# EAGLE design tm4cShield_v2.0 (EAGLE 8.0.0)
CNAME: ARL

## Sheet 1 of 2: Power Input, Conditioning
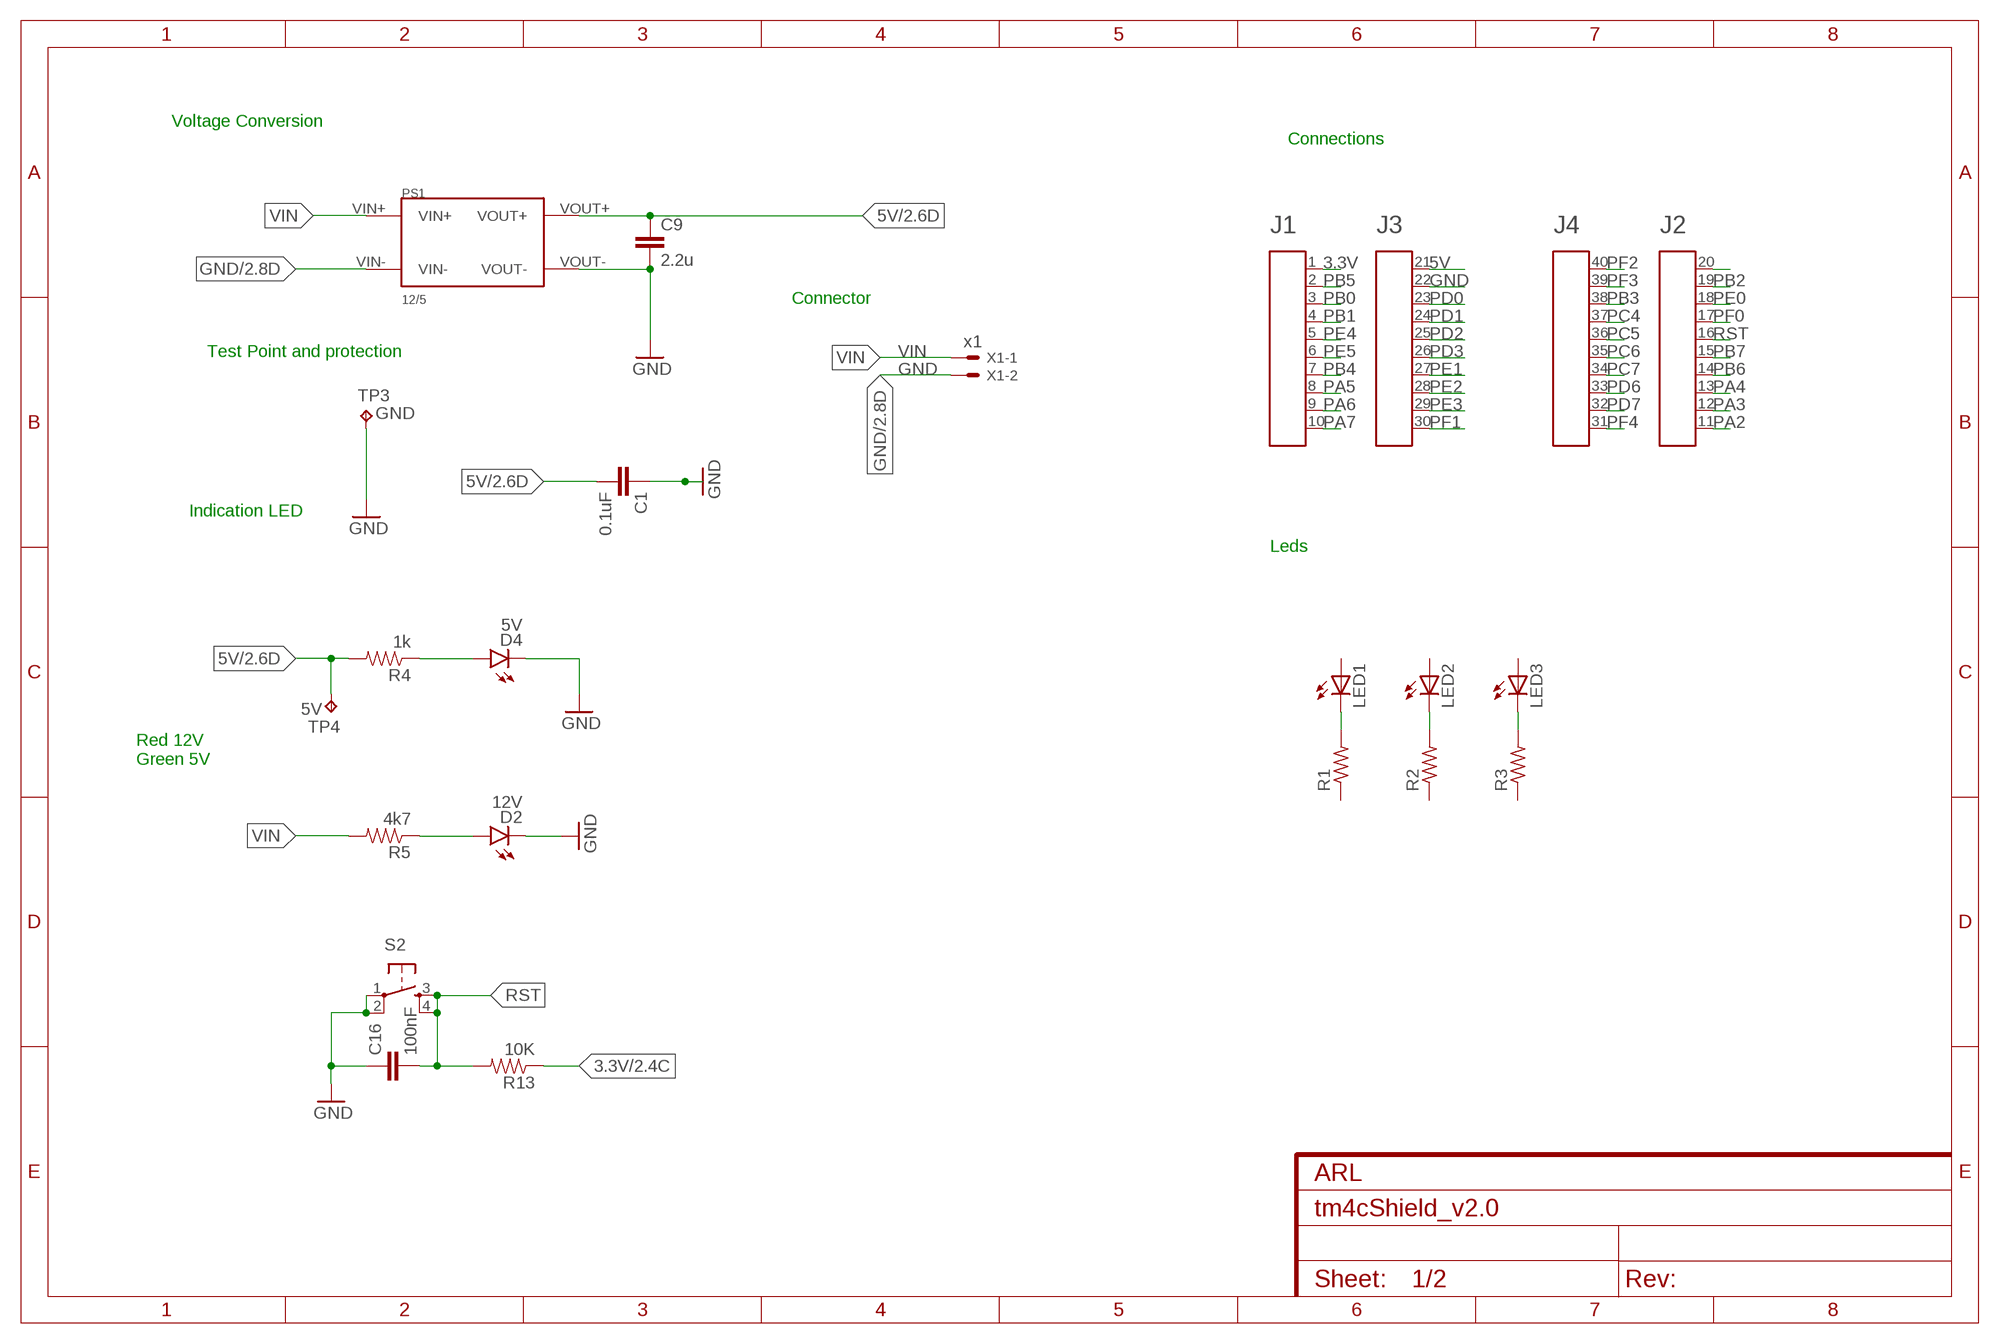
[diagram p0: schematic, sheet 1]

### Parts
A1  HEADER4X10-BOOSTERPACK  [4X10-BOOSTERPACK]
C1  0.1uF  0.1UF-0603-25V-(+80/-20%)  [0603]
C9  2.2u  2.2U_CAPACITOR_0603  [0603-CAP]
C16  100nF  CAP0603-CAP  [0603-CAP]
D2  12V  YELLOW_LED_0603  [LED-0603]
D4  5V  BLUE_LED_0603  [LED-0603]
LED1  LED0603  [LED-0603]
LED2  LED0603  [LED-0603]
LED3  LED0603  [LED-0603]
PS1  12/5  MURATA_NMG2405SC  [MURATA_NMG]
R1  RESISTOR_0603  [RESC0603]
R2  RESISTOR_0603  [RESC0603]
R3  RESISTOR_0603  [RESC0603]
R4  1k  1K_RESISTOR_0603  [0603-RES]
R5  4k7  4K7_RESISTOR_0603  [0603-RES]
R13  10K  RESISTOR0603-RES  [0603-RES]
S2  TAC_SWITCHPTH  [TACTILE-PTH]
TP3  GND  TP5000  [5000_SERIES_TESTPOINT]
TP4  5V  TP5000  [5000_SERIES_TESTPOINT]
X1  x1  53261-02  [53261-02]

### Nets
3.3V: A1.1 R13.1 ; also sheet 2
5V: A1.21 C1.2 C9.1 PS1.VOUT+ R4.2 TP4.P$1(TP) ; also sheet 2
GND: A1.22 C1.1 C9.2 C16.1 D2.C D4.C PS1.VIN- PS1.VOUT- S2.1 S2.2 TP3.P$1(TP) X1.2 ; also sheet 2
N$1: D4.A R4.1
N$2: LED1.C R1.2
N$6: LED2.C R2.2
N$7: LED3.C R3.2
N$14: A1.20
N$35: D2.A R5.1
PA2: A1.11 ; also sheet 2
PA3: A1.12
PA4: A1.13 ; also sheet 2
PA5: A1.8
PA6: A1.9
PA7: A1.10
PB0: A1.3
PB1: A1.4
PB2: A1.19
PB3: A1.38
PB4: A1.7 ; also sheet 2
PB5: A1.2 ; also sheet 2
PB6: A1.14
PB7: A1.15
PC4: A1.37 ; also sheet 2
PC5: A1.36 ; also sheet 2
PC6: A1.35 ; also sheet 2
PC7: A1.34
PD0: A1.23
PD1: A1.24
PD2: A1.25
PD3: A1.26
PD6: A1.33
PD7: A1.32
PE0: A1.18 ; also sheet 2
PE1: A1.27
PE2: A1.28 ; also sheet 2
PE3: A1.29 ; also sheet 2
PE4: A1.5
PE5: A1.6
PF0: A1.17
PF1: A1.30
PF2: A1.40
PF3: A1.39
PF4: A1.31
RST: A1.16 C16.2 R13.2 S2.3 S2.4
VIN: PS1.VIN+ R5.2 X1.1 ; also sheet 2
Unconnected: LED1.A LED2.A LED3.A R1.1 R2.1 R3.1

### Notes on the sheet
- Voltage Conversion
- Connections
- Connector
- Test Point and protection
- Indication LED
- Leds
- Red 12V
  Green 5V

## Sheet 2 of 2
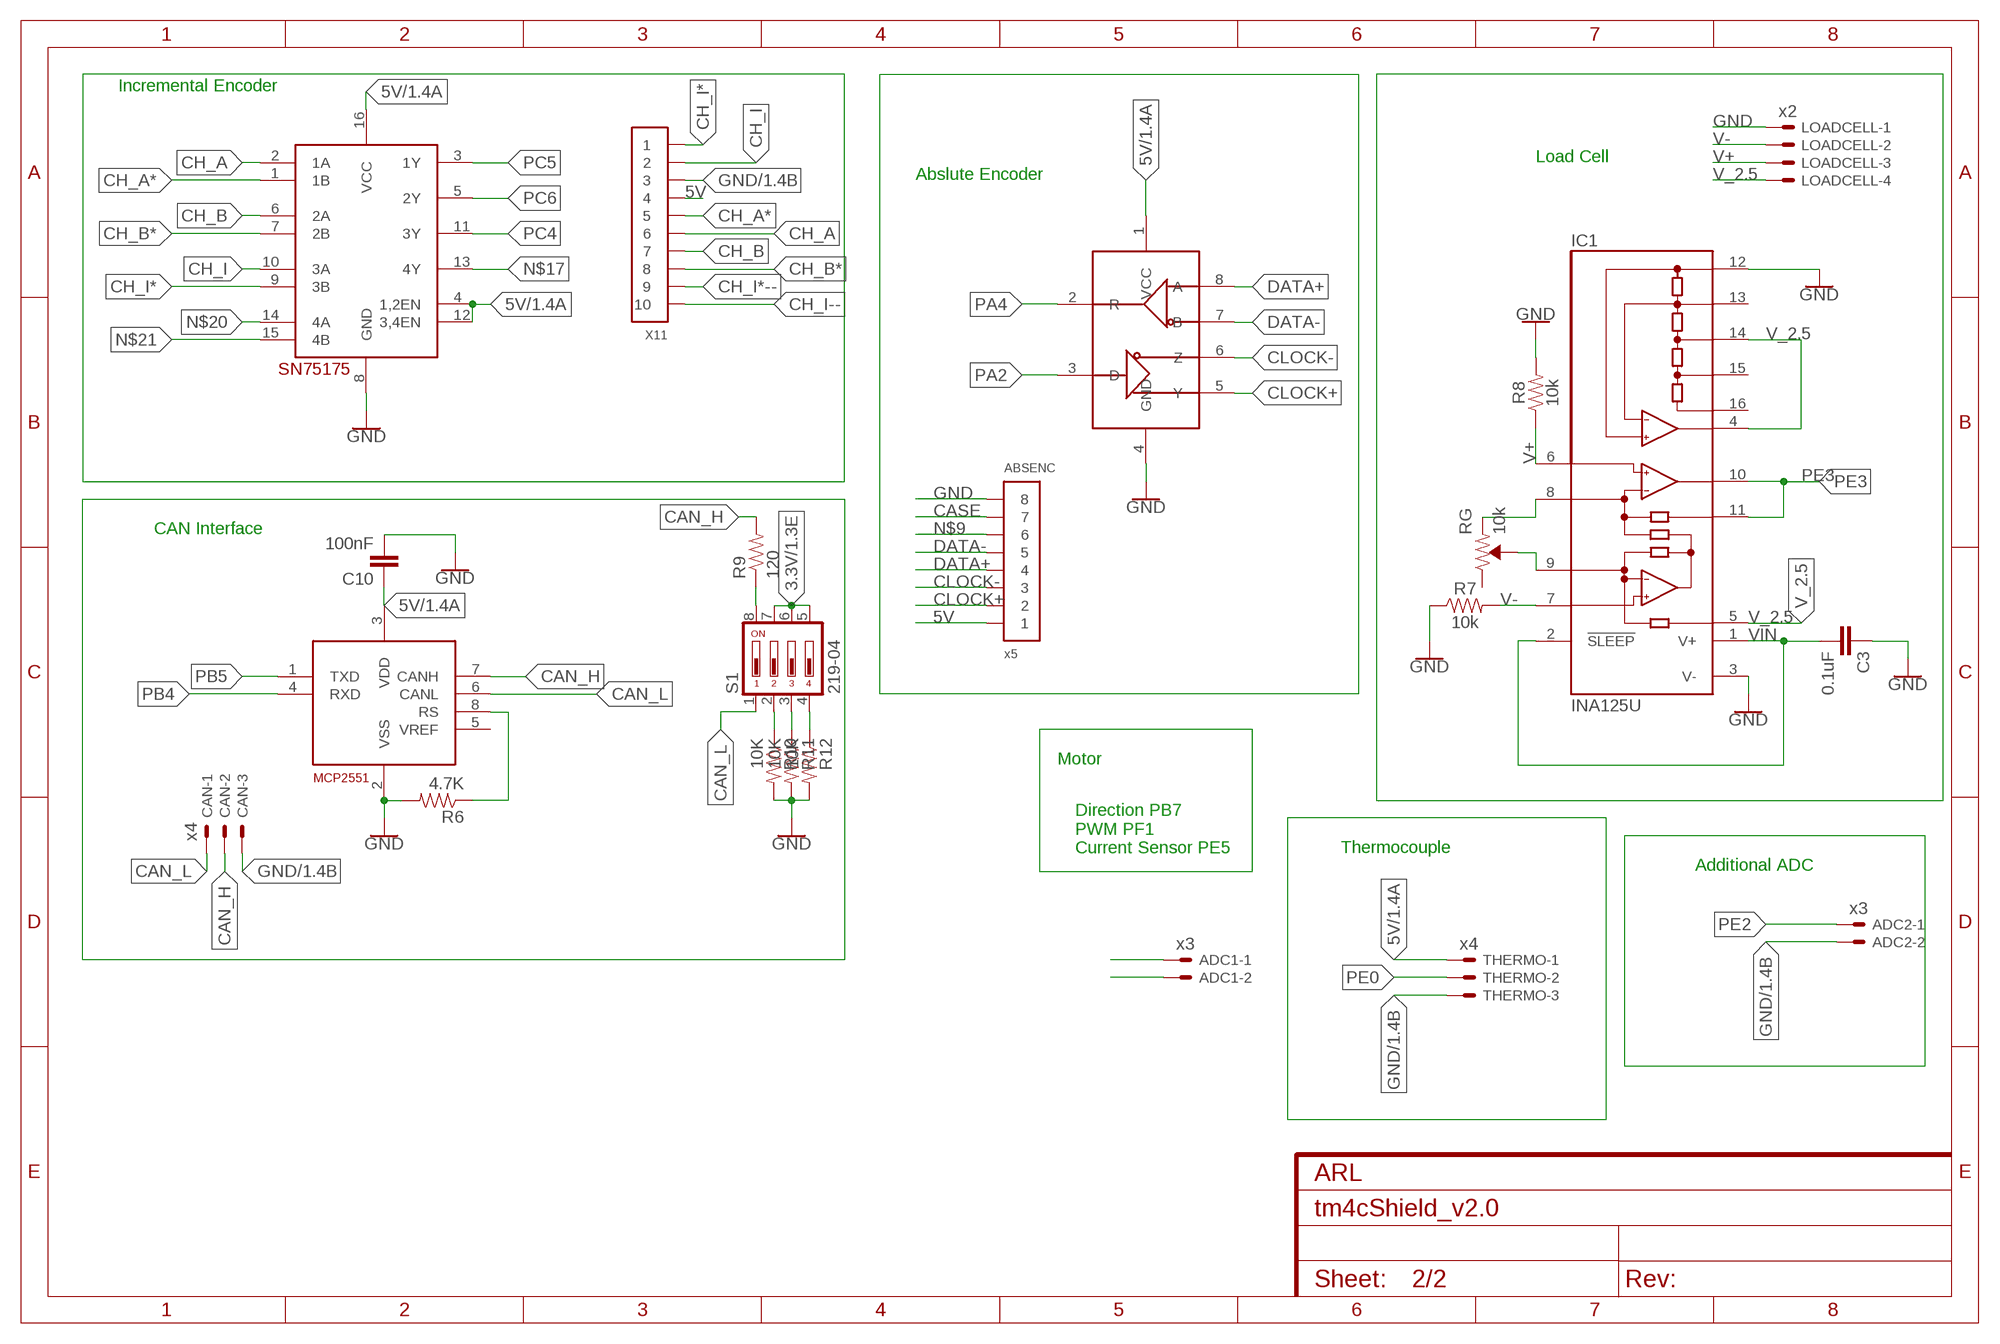
[diagram p1: schematic, sheet 2]

### Parts
ABSENC  x5  CONN_8-1-53261  [PB-53261-08]
ADC1  x3  53261-02  [53261-02]
ADC2  x3  53261-02  [53261-02]
C3  0.1uF  0.1UF-0603-25V-(+80/-20%)  [0603]
C10  100nF  CAP0603-CAP  [0603-CAP]
CAN  x4  53261-03  [53261-03]
IC1  INA125U  [SO16-1]
LOADCELL  x2  53261-04  [53261-04]
R6  4.7K  RESISTOR0603-RES  [0603-RES]
R7  10k  0.05OHM-0603-1/5W-1%  [0603]
R8  10k  0.05OHM-0603-1/5W-1%  [0603]
R9  120  RESISTOR0603-RES  [0603-RES]
R10  10K  RESISTOR0603-RES  [0603-RES]
R11  10K  RESISTOR0603-RES  [0603-RES]
R12  10K  RESISTOR0603-RES  [0603-RES]
RG  10k  TRIMPOT-PTH-10MM-KNOB-1/2W-10%  [TRIMPOT-PTH-3386U]
S1  219-04  [CTS-219-04]
THERMO  x4  53261-03  [53261-03]
U2  MCP2551  [SOIC8]
U$2  SN75175  [SOIC16]
U$4  SP490  [SOIC8]
X11  CONN_10-1-53261  [PB-53261-10]

### Nets
3.3V: S1.5 S1.6 S1.7 ; also sheet 1
5V: ABSENC.1 C10.1 THERMO.1 U2.3(VDD) U$2.4(1,2EN) U$2.12(3,4EN) U$2.16(VCC) U$4.1(VCC) X11.4 ; also sheet 1
CAN_H: CAN.2 R9.2 U2.7(CANH)
CAN_L: CAN.1 S1.1 U2.6(CANL)
CASE: ABSENC.7
CH_A: U$2.2(1A) X11.6
CH_A*: U$2.1(1B) X11.5
CH_B: U$2.6(2A) X11.7
CH_B*: U$2.7(2B) X11.8
CH_I: U$2.10(3A) X11.2
CH_I*: U$2.9(3B) X11.1
CH_I*--: X11.9
CH_I--: X11.10
CLOCK+: ABSENC.2 U$4.5(Y)
CLOCK-: ABSENC.3 U$4.6(Z)
DATA+: ABSENC.4 U$4.8(A)
DATA-: ABSENC.5 U$4.7(B)
GND: ABSENC.8 ADC2.2 C3.1 C10.2 CAN.3 IC1.3(V-) IC1.12(REFCOM) LOADCELL.1 R6.2 R7.1 R8.2 R10.2 R11.2 R12.2 THERMO.3 U2.2(VSS) U$2.8(GND) U$4.4(GND) X11.3 ; also sheet 1
N$3: IC1.8(RG) RG.1(CCW)
N$9: ABSENC.6
N$10: IC1.9(RG) RG.2(WIPER)
N$15: ADC1.1
N$16: ADC1.2
N$17: U$2.13(4Y)
N$18: R9.1 S1.8
N$20: U$2.14(4A)
N$21: U$2.15(4B)
N$23: R6.1 U2.8(RS)
N$25: R10.1 S1.2
N$26: R11.1 S1.3
N$27: R12.1 S1.4
PA2: U$4.3(D) ; also sheet 1
PA4: U$4.2(R) ; also sheet 1
PB4: U2.4(RXD) ; also sheet 1
PB5: U2.1(TXD) ; also sheet 1
PC4: U$2.11(3Y) ; also sheet 1
PC5: U$2.3(1Y) ; also sheet 1
PC6: U$2.5(2Y) ; also sheet 1
PE0: THERMO.2 ; also sheet 1
PE2: ADC2.1 ; also sheet 1
PE3: IC1.10(OUT) IC1.11(SENSE) ; also sheet 1
V+: IC1.6(+IN) LOADCELL.3 R8.1
V-: IC1.7(-IN) LOADCELL.2 R7.2
V_2.5: IC1.4(REFOUT) IC1.5(REF) IC1.14(REF2.5) LOADCELL.4
VIN: C3.2 IC1.1(V+) IC1.2(!SLEEP) ; also sheet 1
Unconnected: IC1.13(REFBG) IC1.15(REF5) IC1.16(REF10) RG.3(CW) U2.5(VREF)

### Notes on the sheet
- Incremental Encoder
- Load Cell
- Abslute Encoder
- CAN Interface
- Motor
- Encoder Conditioning
- Encoder 0
- Direction PB7
  PWM PF1
  Current Sensor PE5
- Thermocouple
- Additional ADC
- Encoder 1

## Library data of the parts
A1 = EAGLE_BoosterPack_Library:HEADER4X10-BOOSTERPACK
ABSENC = pel_molex:CONN_8-1; PARTNO: 0532610871
ADC1 ADC2 X1 = con-molex:53?-02: CONNECTOR wire to board 1.25 mm (.049 inch) pitch header; OC_FARNELL: 1125373; OC_NEWARK: unknown
C1 C3 = SparkFun-Capacitors:0.1UF: 0.1µF ceramic capacitors A capacitor is a passive two-terminal electrical component used to store electrical energy temporarily in an electric field.; PROD_ID: CAP-00810
C9 = test_Beast_Elmo_Twitter_Carrier_Board_V1:2.2U_CAPACITOR_0603: Multilayer Ceramic Capacitors MLCC - SMD/SMT 0603 2.2uF 50volts X5R 10%; MPN: GRM188R61H225KE11D
C10 = SparkFun:CAP: Capacitor Standard 0603 ceramic capacitor, and 0.1" leaded capacitor.; PARTNO: C1608X7R1E104K
C16 = SparkFun-Passives:CAP: Capacitor Standard 0603 ceramic capacitor, and 0.1" leaded capacitor.; PARTNO: C1608X7R1E104K
CAN THERMO = con-molex:53?-03: CONNECTOR wire to board 1.25 mm (.049 inch) pitch header; MF: MOLEX; MPN: 53261-0390; OC_FARNELL: 1125359; OC_NEWARK: 57H5006
D2 = test_Beast_Elmo_Twitter_Carrier_Board_V1:YELLOW_LED_0603: LED YELLOW DIFFUSED 0603 SMD; MPN: LY L296-Q2R2-26-Z
D4 = test_Beast_Elmo_Twitter_Carrier_Board_V1:BLUE_LED_0603: LED BLUE DIFFUSED 0603 SMD; MPN: LB L293-M2P1-36-1-Z
IC1 = burr-brown:INA125: Instrumentation Amplifier with Precision Voltage Reference; MF: TEXAS INSTRUMENT CONNECTORS; MPN: INA125U; OC_FARNELL: 1304375; OC_NEWARK: 80K5901
LED1-LED3 = EAGLE_BoosterPack_Library:LED: LEDs Standard schematic elements and footprints for 5mm, 3mm, 1206, and 0603 sized LEDs. 5mm - Spark Fun Electronics SKU : COM-00529 (and others)
LOADCELL = con-molex:53?-04: CONNECTOR wire to board 1.25 mm (.049 inch) pitch header; OC_FARNELL: 1125374; OC_NEWARK: unknown
PS1 = murata-supplys:MURATA_NMG2405SC: DC/DC CONVERTER 5V 400MA 2W; MPN: NMG2405SC
R1-R3 = EAGLE_BoosterPack_Library:RESISTOR_
R4 = test_Beast_Elmo_Twitter_Carrier_Board_V1:1K_RESISTOR_0603: RES SMD 1K OHM 1% 1/10W 0603; MPN: CRCW06031K00FKEA
R5 = test_Beast_Elmo_Twitter_Carrier_Board_V1:4K7_RESISTOR_0603: RES SMD 4.7K OHM 1% 1/10W 0603; MPN: CRCW06034K70FKEA
R6 = SparkFun:RESISTOR: Resistor Basic schematic elements and footprints for 0603, 1206, and PTH resistors.; PARTNO: ERJ-3EKF4701V
R7 R8 = SparkFun-Resistors:0.05OHM: 0.05Ω resistor A resistor is a passive two-terminal electrical component that implements electrical resistance as a circuit element. Resistors act to reduce current flow, and, at the same time, act to lower voltage levels within circuits. - Wikipedia; PROD_ID: RES-12535; VALUE: 0.05
R9 = SparkFun:RESISTOR: Resistor Basic schematic elements and footprints for 0603, 1206, and PTH resistors.; PARTNO: ERJ-3GEYJ121V
R10-R12 = SparkFun:RESISTOR: Resistor Basic schematic elements and footprints for 0603, 1206, and PTH resistors.; PARTNO: ERJ-3EKF1002V
R13 = SparkFun-Passives:RESISTOR: Resistor Basic schematic elements and footprints for 0603, 1206, and PTH resistors.; PARTNO: ERJ-3EKF1002V
RG = SparkFun-Resistors:TRIMPOT: Trimming Potentiometer (Trimpot) Three-terminal potentiometers, with an adjustable wiper and two adjustable resistors. A pot can be used to create a configurable voltage divider, or as a variable resistor. "Trimpots" are a subset of potentiometers, usually intended for "set-and-forget" applications. They're often more delicate than standard potentiometers - rated for fewer turns. Variants PTH-KNOB - PTH Trimpot w/ finger-adjustable knob Trimpot 10K with Knob <https://www.sparkfun.com/products/9806> (COM-09806) Datasheet <http://www.sparkfun.com/datasheets/Components/General/TSR-3386.pdf> SMD-3MM-CLOSED-FRAME - SMD 3mm Square Closed-Frame Trimpot Used on e.g. EasyDriver - Stepper Motor Driver <https://www.sparkfun.com/products/12779> Datasheet <http://www.bitechnologies.com/pdfs/22.pdf> (22AR10KTR) SMD-5MM - SMD 5mm Square Closed-Frame Trimpot Used on e.g. IOIO-OTG - V2.2 <https://www.sparkfun.com/products/13613> Datasheet <http://www.vishay.com/docs/51008/ts53.pdf> (TS53YL502MR10) SMD-3MM-1/10W-25% - 3mm Square Open-Frame Trimpot Used on e.g. SparkFun Shapeoko <https://www.sparkfun.com/products/13899> Datasheet <http://www.bourns.com/docs/Product-Datasheets/TC33.pdf> (TC33X-2-103E); PROD_ID: RES-09730; SF_SKU: COM-09806
S1 = switch-dil:219-04*: Surface Mount DIP Switch Series 219 SMT CTS Electronic Components Sourc: www.ctscorp.com; DIGIKEY: CT2194LPST-ND; OC_FARNELL: unknown; OC_NEWARK: unknown; PARTNO: 219-4LPST
S2 = SparkFun-Electromechanical:TAC_SWITCH: Momentary Switch Button commonly used for reset or general input. Spark Fun Electronics SKU : COM-00097; PARTNO: B3F-1005
TP3 TP4 = testpad:TP: Test pad; COLOR: White; MPN: 5002
U2 = RoMeLa:MCP2551; PARTNO: MCP2551-I/SN
U$2 = RoMeLa:SN75175; PARTNO: SN75175DR
U$4 = RoMeLa:SP490; PARTNO: SP490CN-L
X11 = pel_molex:CONN_10-1; PARTNO: 0532611071

## Board
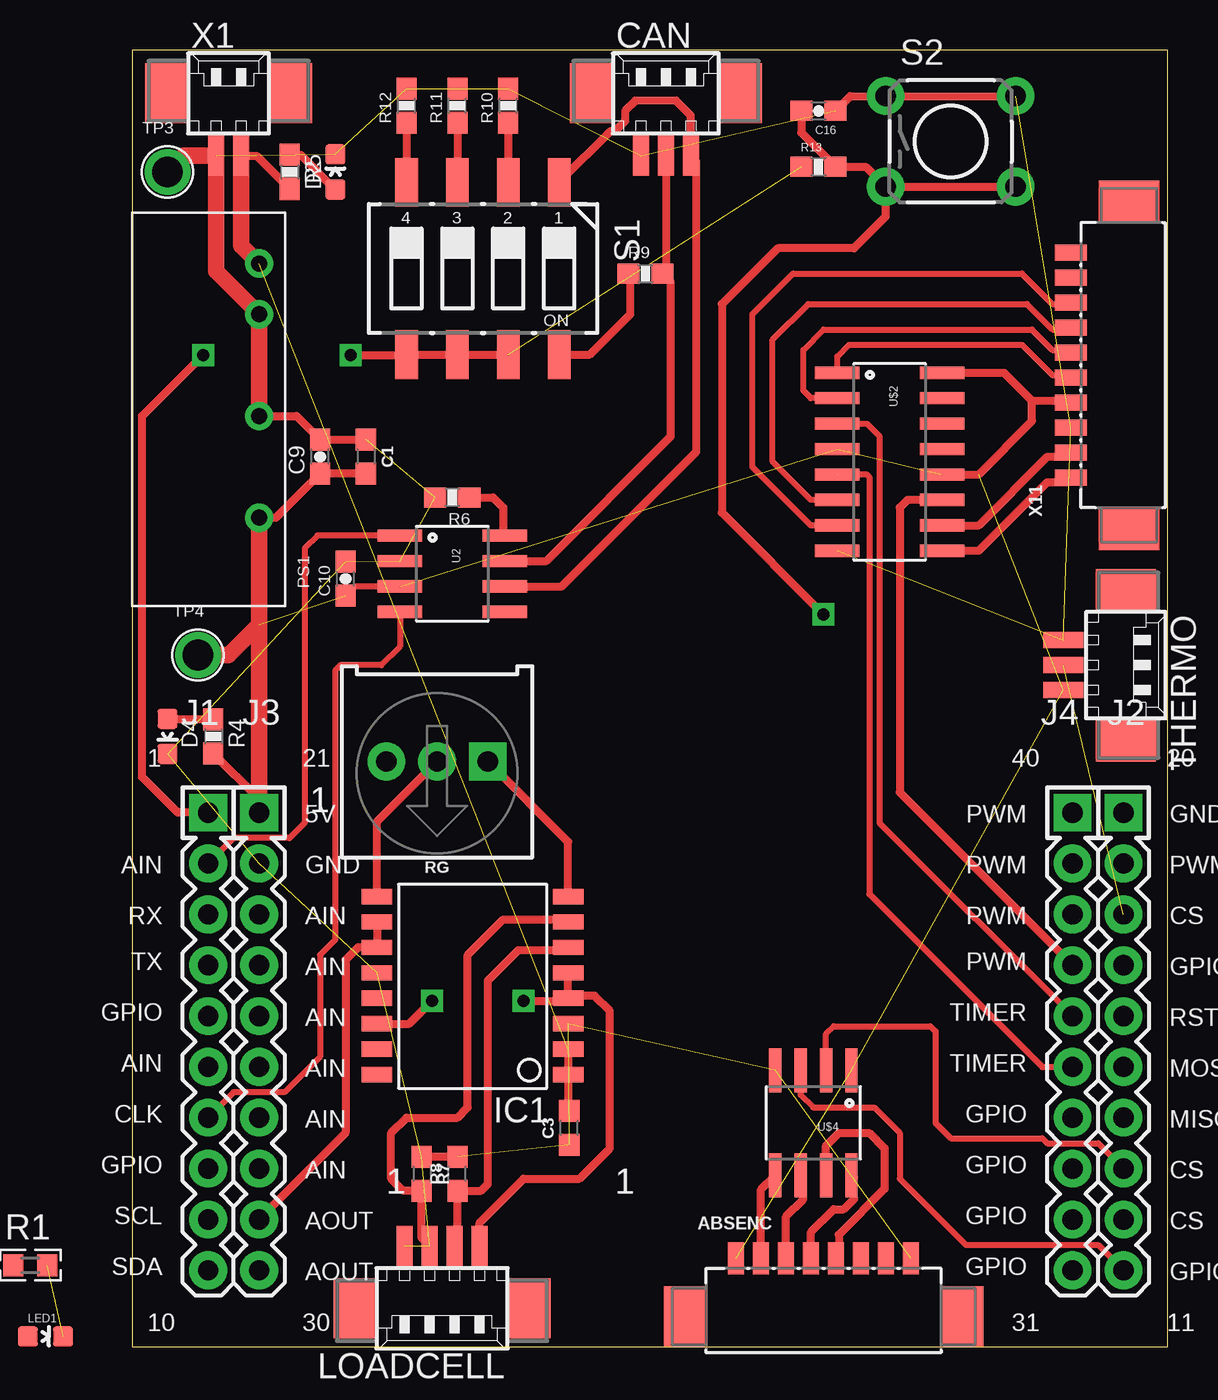
[diagram p2: board, top side]
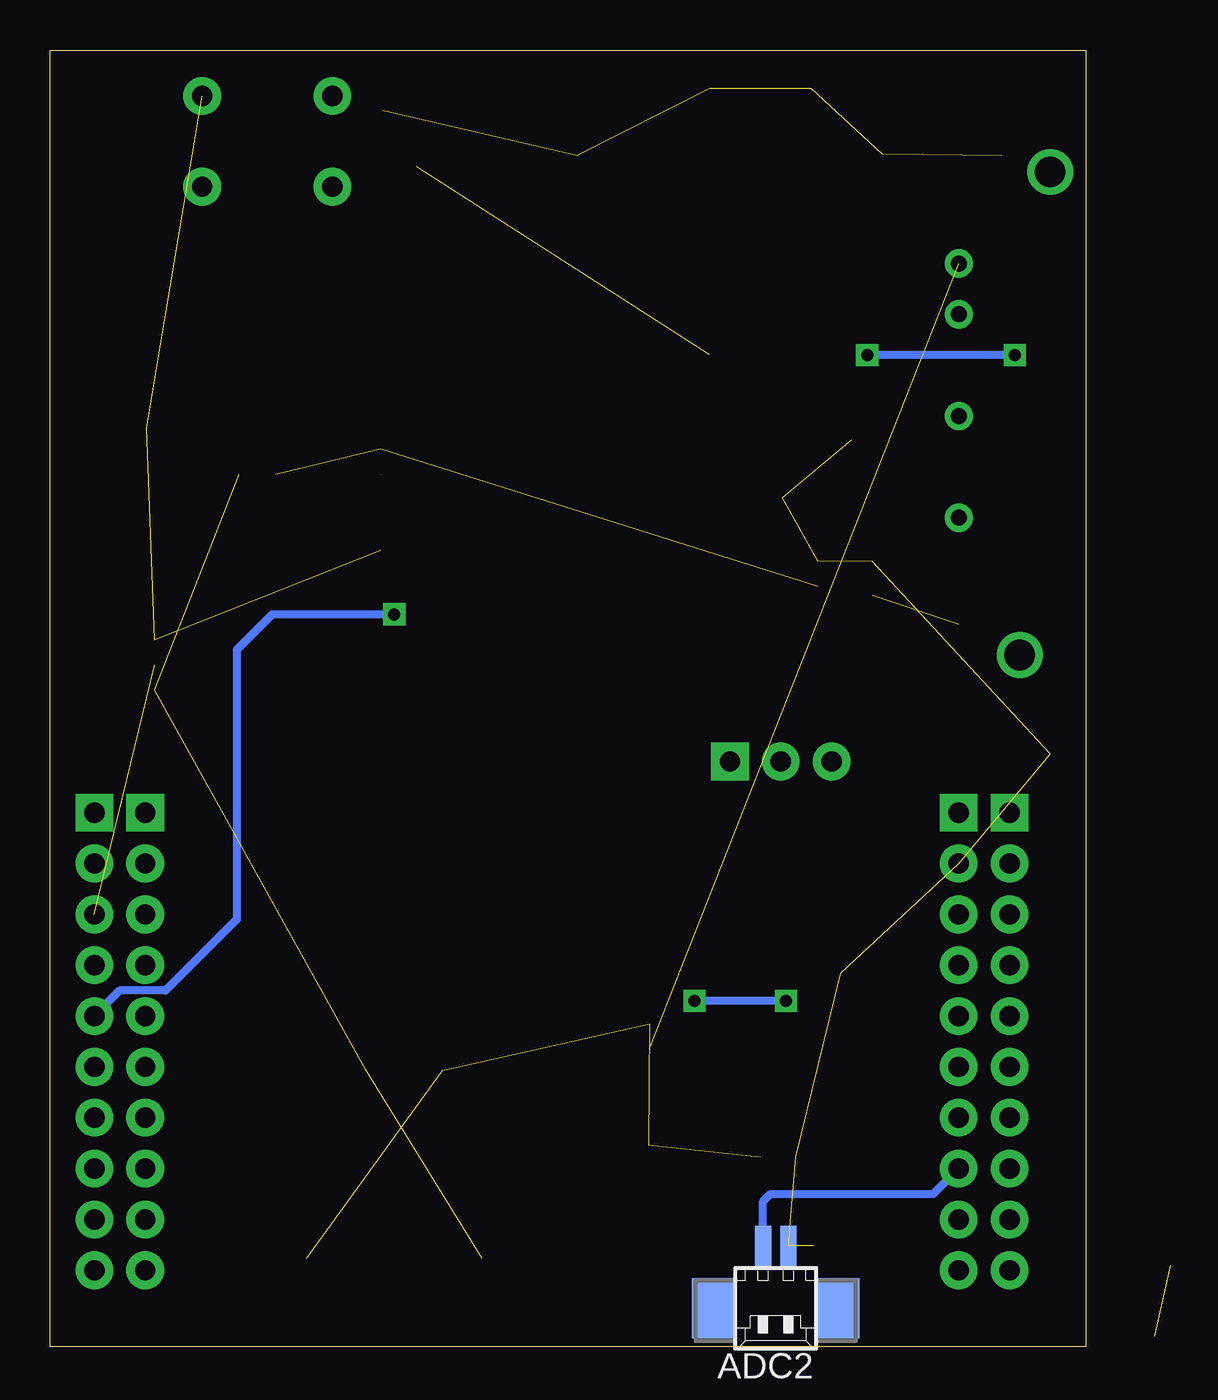
[diagram p3: board, bottom side, seen from below]

Size 51.74 x 64.76 mm. Coordinates in mm from the lower left corner, seen from the top.
Outline: 0,0 51.74,0 51.74,64.76 0,64.76 0,0
Copper layers (1*16): Top 0.035mm / dielectric 1.5mm / Bottom 0.035mm
Design rules "SparkFun": minimum track width 8mil, minimum drill 20mil, track to track 8mil, track to pad 8mil, pad to pad 8mil, via to via 8mil, smd to smd 8mil, copper to edge 10mil, drill to drill 8mil, minimum pad ring 12mil, minimum via ring 10mil, stop-mask expansion 4mil, vias tented up to drill 25mil, thermal gap 10mil

### Footprints (pad centres in the part's own frame; a part is rotated, then mirrored left to right if it is on the bottom)
4X10-BOOSTERPACK = drill 1.016 pad 1.88 square: 1 0,10.16; 20 45.72,10.16; 21 2.54,10.16; 40 43.18,10.16 | drill 1.016 pad 1.88: 2 0,7.62; 3 0,5.08; 4 0,2.54; 5 0,0; 6 0,-2.54; 7 0,-5.08; 8 0,-7.62; 9 0,-10.16; 10 0,-12.7; 11 45.72,-12.7; 12 45.72,-10.16; 13 45.72,-7.62; 14 45.72,-5.08; 15 45.72,-2.54; 16 45.72,0; 17 45.72,2.54; 18 45.72,5.08; 19 45.72,7.62; 22 2.54,7.62; 23 2.54,5.08; 24 2.54,2.54; 25 2.54,0; 26 2.54,-2.54; 27 2.54,-5.08; 28 2.54,-7.62; 29 2.54,-10.16; 30 2.54,-12.7; 31 43.18,-12.7; 32 43.18,-10.16; 33 43.18,-7.62; 34 43.18,-5.08; 35 43.18,-2.54; 36 43.18,0; 37 43.18,2.54; 38 43.18,5.08; 39 43.18,7.62
PB-53261-08 = smd 0.8 x 1.6: 1 -4.375,1.1; 2 -3.125,1.1; 3 -1.875,1.1; 4 -0.625,1.1; 5 0.625,1.1; 6 1.875,1.1; 7 3.125,1.1; 8 4.375,1.1 | smd 2.1 x 3: MNT1 -6.925,-1.8; MNT2 6.925,-1.8
53261-02 = smd 0.8 x 2: 1 0.625,-2.5; 2 -0.625,-2.5 | smd 2.1 x 3: S1 3.125,0.625; S2 -3.125,0.625
0603 = smd 1.1 x 1: 1 -0.85,0; 2 0.85,0
0603-CAP = smd 1.1 x 1: 1 -0.85,0; 2 0.85,0
53261-03 = smd 0.8 x 2: 1 1.25,-2.5; 2 0,-2.5; 3 -1.25,-2.5 | smd 2.1 x 3: S1 3.75,0.625; S2 -3.75,0.625
LED-0603 = smd 1 x 1: A 0,-0.877; C 0,0.877
SO16-1 = smd 0.762 x 1.524: 1 -4.445,-4.775; 2 -3.175,-4.775; 3 -1.905,-4.775; 4 -0.635,-4.775; 5 0.635,-4.775; 6 1.905,-4.775; 7 3.175,-4.775; 8 4.445,-4.775; 9 4.445,4.775; 10 3.175,4.775; 11 1.905,4.775; 12 0.635,4.775; 13 -0.635,4.775; 14 -1.905,4.775; 15 -3.175,4.775; 16 -4.445,4.775
53261-04 = smd 0.8 x 2: 1 1.875,-2.5; 2 0.625,-2.5; 3 -0.625,-2.5; 4 -1.875,-2.5 | smd 2.1 x 3: S1 4.375,0.625; S2 -4.375,0.625
MURATA_NMG = drill 0.8: VIN+ 2.54,6.35; VIN- 5.08,6.35; VOUT+ 15.24,6.35; VOUT- 10.16,6.35
RESC0603 = smd 1 x 1.1: 1 -0.85,0; 2 0.85,0
0603-RES = smd 1.1 x 1: 1 -0.85,0; 2 0.85,0
TRIMPOT-PTH-3386U = drill 1.016 pad 1.88 square: 1 -2.54,-0.015 | drill 1.016 pad 1.88: 2 0,-0.015; 3 2.54,-0.015
CTS-219-04 = smd 1.13 x 2.44: 1 -3.81,-4.3; 2 -1.27,-4.3; 3 1.27,-4.3; 4 3.81,-4.3; 5 3.81,4.3; 6 1.27,4.3; 7 -1.27,4.3; 8 -3.81,4.3
TACTILE-PTH = drill 1.016 pad 1.88: 1 -3.251,2.261; 2 3.251,2.261; 3 -3.251,-2.261; 4 3.251,-2.261
5000_SERIES_TESTPOINT = drill 1.524 pad 2.032: P$1 0,0
SOIC8 = smd 0.61 x 2.21: 1 -1.905,-2.616; 2 -0.635,-2.616; 3 0.635,-2.616; 4 1.905,-2.616; 5 1.905,2.616; 6 0.635,2.616; 7 -0.635,2.616; 8 -1.905,2.616
SOIC16 = smd 0.61 x 2.21: 1 -4.445,-2.616; 2 -3.175,-2.616; 3 -1.905,-2.616; 4 -0.635,-2.616; 5 0.635,-2.616; 6 1.905,-2.616; 7 3.175,-2.616; 8 4.445,-2.616; 9 4.445,2.616; 10 3.175,2.616; 11 1.905,2.616; 12 0.635,2.616; 13 -0.635,2.616; 14 -1.905,2.616; 15 -3.175,2.616; 16 -4.445,2.616
PB-53261-10 = smd 0.8 x 1.6: 1 -5.625,1.1; 2 -4.375,1.1; 3 -3.125,1.1; 4 -1.875,1.1; 5 -0.625,1.1; 6 0.625,1.1; 7 1.875,1.1; 8 3.125,1.1; 9 4.375,1.1; 10 5.625,1.1 | smd 2.1 x 3: MNT1 -8.175,-1.8; MNT2 8.175,-1.8

### Placement (x,y rotation side)
A1  3.81,16.51 0 top
ABSENC  34.54,3.3 0 top
ADC1  -5.33,-11.43 0 top  (outside the outline)
ADC2  15.49,2.54 180 bottom
C1  11.68,44.45 270 top
C3  21.84,10.92 90 top
C9  9.4,44.45 90 top
C10  10.67,38.35 90 top
C16  34.29,61.72 180 top
CAN  26.67,61.98 0 top
D2  10.16,58.67 0 top
D4  1.78,30.48 180 top
IC1  17.02,18.03 90 top
LED1  -4.32,0.51 270 top  (outside the outline)
LED2  61.21,27.18 90 top  (outside the outline)
LED3  65.02,22.1 90 top  (outside the outline)
LOADCELL  15.49,2.54 180 top
PS1  0,56.64 270 top
R1  -5.08,4.06 0 top  (outside the outline)
R2  64.52,31.5 0 top  (outside the outline)
R3  58.17,23.88 0 top  (outside the outline)
R4  4.06,30.48 270 top
R5  7.87,58.67 270 top
R6  16,42.42 180 top
R7  14.48,8.64 270 top
R8  16.26,8.64 90 top
R9  25.65,53.59 0 top
R10  18.8,61.98 90 top
R11  16.26,61.98 90 top
R12  13.72,61.98 90 top
R13  34.29,58.93 0 top
RG  15.24,29.21 180 top
S1  17.53,53.85 180 top
S2  40.89,60.2 0 top
THERMO  49.02,34.04 270 top
TP3  1.78,58.67 0 top
TP4  3.3,34.54 0 top
U2  16,38.61 270 top
U$2  37.85,44.2 270 top
U$4  34.04,11.18 180 top
X1  4.83,61.98 0 top
X11  48.01,49.02 90 top

### Tracks (layer width: path | path; a pad name or v marks a point on that pad's centre or on a via)
3.3V  (via drill 0.6)  (1 unrouted)
  Top 0.406: A1.1 2.29,26.67 0.51,28.45 0.51,46.48 v3.56,49.53 | v10.92,49.53 13.7,49.53 S1.5 S1.6 S1.7
  Bottom 0.406: v3.56,49.53 v10.92,49.53
5V  (6 unrouted)
  Top 0.305: U2.3 11.14,37.97 C10.1
  Top 0.406: PS1.VOUT+ 7.2,41.4 C9.1 C1.2 | A1.21 6.35,27.34 R4.2 | U$2.16 43.56,48.64 44.96,47.24 | 44.96,47.24 46.81,47.24 X11.4 | U$2.12 42.29,43.56 44.96,46.23 44.96,47.24
  Top 0.813: 6.35,36.07 6.35,26.92 6.86,26.42 6.6,26.42 A1.21 | 6.35,36.07 PS1.VOUT+ | TP4.P$1 4.83,34.54 6.35,36.07
CAN_H
  Top 0.406: U2.7 20.7,39.24 26.92,45.47 26.92,53.17 R9.2 26.67,53.76 CAN.2
CAN_L
  Top 0.406: U2.6 21.46,37.97 28.19,44.7 28.19,59.2 CAN.1 27.92,61.49 27.18,62.23 25.15,62.23 24.64,61.72 24.64,61.21 24.13,60.71 23.89,60.71 S1.1
CH_A
  Top 0.305: U$2.2 33.91,47.37 33.53,47.75 33.53,49.78 34.54,50.8 44.96,50.8 45.97,49.78 46.77,49.78 X11.6
CH_A*
  Top 0.305: U$2.1 35.23,49.45 35.81,50.04 44.45,50.04 45.97,48.51 46.79,48.51 X11.5
CH_B
  Top 0.305: U$2.6 33.91,42.29 32,44.2 32,50.29 33.78,52.07 44.7,52.07 45.97,50.8 46.81,50.8 X11.7
CH_B*
  Top 0.305: U$2.7 33.91,41.02 30.99,43.94 30.99,51.56 33.02,53.59 44.45,53.59 45.97,52.07 46.83,52.07 X11.8
CH_I
  Top 0.406: U$2.10 42.29,41.02 45.72,44.45 46.71,44.45 X11.2
CH_I*
  Top 0.406: U$2.9 42.29,39.75 45.72,43.18 46.69,43.18 X11.1
CLOCK+
  Top 0.406: ABSENC.2 31.42,7.85 U$4.5
CLOCK-
  Top 0.406: ABSENC.3 32.67,6.51 33.53,7.37 33.53,8.43 U$4.6
DATA+
  Top 0.406: ABSENC.4 33.92,5.73 35.05,6.86 35.56,6.86 36.07,7.37 36.07,8.43 U$4.8
DATA-
  Top 0.406: U$4.7 34.67,10.03 35.31,10.67 36.83,10.67 37.59,9.91 37.59,7.87 35.31,5.59 35.31,4.54 ABSENC.5
GND  (22 unrouted)
  Top 0.406: PS1.VOUT- 8.22,46.48 C9.2 C1.1 | LOADCELL.1 | R8.2 R7.1 | C16.1 35.88,62.46 S2.1 S2.2
  Top 0.813: TP3.P$1 2.58,59.48 X1.2 4.2,53.71 PS1.VIN- PS1.VOUT-
N$1
  Top 0.406: R4.1 1.8,31.33 D4.A
N$2  (1 unrouted)
N$3
  Top 0.406: IC1.8 21.79,25.21 RG.1
N$6  (1 unrouted)
N$7  (1 unrouted)
N$10
  Top 0.406: IC1.9 12.24,26.23 RG.2
N$18
  Top 0.406: S1.8 22.88,49.55 24.89,51.56 24.89,53.51 R9.1
N$23
  Top 0.406: R6.1 18.03,42.42 18.54,41.91 18.54,40.59 U2.8
N$25
  Top 0.406: R10.1 S1.2
N$26
  Top 0.406: R11.1 S1.3
N$27
  Top 0.406: R12.1 S1.4
N$35
  Top 0.406: R5.1 8.43,59.52 D2.A
PA2
  Top 0.305: U$4.3 33.4,12.57 34.04,11.94 37.08,11.94 38.35,10.67 38.35,8.38 41.66,5.08 48.26,5.08 A1.11
PA4
  Top 0.305: U$4.2 34.67,15.62 35.05,16 39.88,16 40.13,15.75 40.13,11.18 40.89,10.41 45.47,10.41 45.72,10.16 48.26,10.16 A1.13
PB4
  Top 0.305: U2.4 13.39,34.98 12.45,34.04 10.41,34.04 10.16,33.78 10.16,20.32 9.4,19.56 9.4,14.48 7.62,12.7 5.08,12.7 A1.7
PB5
  Top 0.305: U2.1 9.27,40.51 8.64,39.88 8.64,26.16 7.87,25.4 5.08,25.4 A1.2
PC4
  Top 0.406: U$2.11 38.73,42.29 38.35,41.91 38.35,27.69 A1.37
PC5
  Top 0.305: U$2.3 36.7,46.1 37.34,45.47 37.34,26.16 A1.36
PC6  (1 unrouted)
  Top 0.305: U$2.5 36.7,43.56 36.83,43.43 36.83,22.61 45.47,13.97 A1.35
PE0  (1 unrouted)
PE2
  Bottom 0.406: ADC2.1 16.12,7.25 15.75,7.62 7.62,7.62 A1.28
PE3
  Top 0.406: IC1.10 IC1.11 11.3,19.94 10.67,19.3 10.67,10.67 A1.29
RST  (via drill 0.6)
  Top 0.406: S2.3 36.65,58.93 R13.2 33.44,60.63 C16.2 | S2.3 37.64,56.44 36.07,54.86 32.26,54.86 29.46,52.07 29.46,41.66 v34.54,36.58 | S2.3 S2.4
  Bottom 0.406: v34.54,36.58 40.64,36.58 42.42,34.8 42.42,21.34 45.97,17.78 48.26,17.78 A1.16
V+
  Top 0.406: LOADCELL.3 16.26,5.18 R8.1 17.44,7.79 17.78,8.13 17.78,18.29 19.3,19.81 21.67,19.81 IC1.6
V-
  Top 0.406: LOADCELL.2 14.48,5.43 R7.2 13.55,7.79 12.95,8.38 12.95,10.67 13.72,11.43 16.26,11.43 16.76,11.94 16.76,19.56 18.54,21.34 21.67,21.34 IC1.7
V_2.5  (via drill 0.6)
  Top 0.406: IC1.4 IC1.5 | LOADCELL.4 17.37,6.19 19.56,8.38 22.35,8.38 23.88,9.91 23.88,16.76 23.11,17.53 21.92,17.53 IC1.4 | IC1.14 13.84,16.13 v14.99,17.27 | v19.56,17.27 21.67,17.27 IC1.4
  Bottom 0.406: v14.99,17.27 v19.56,17.27
VIN  (1 unrouted)
  Top 0.406: X1.1 6.22,59.48 R5.2 | IC1.2 IC1.1 21.79,11.82 C3.2
  Top 0.813: X1.1 5.45,55 PS1.VIN+

### Text on the board
tPlace: 1 | 1 | 1